# EAGLE design MrRoboto (EAGLE 6.1)
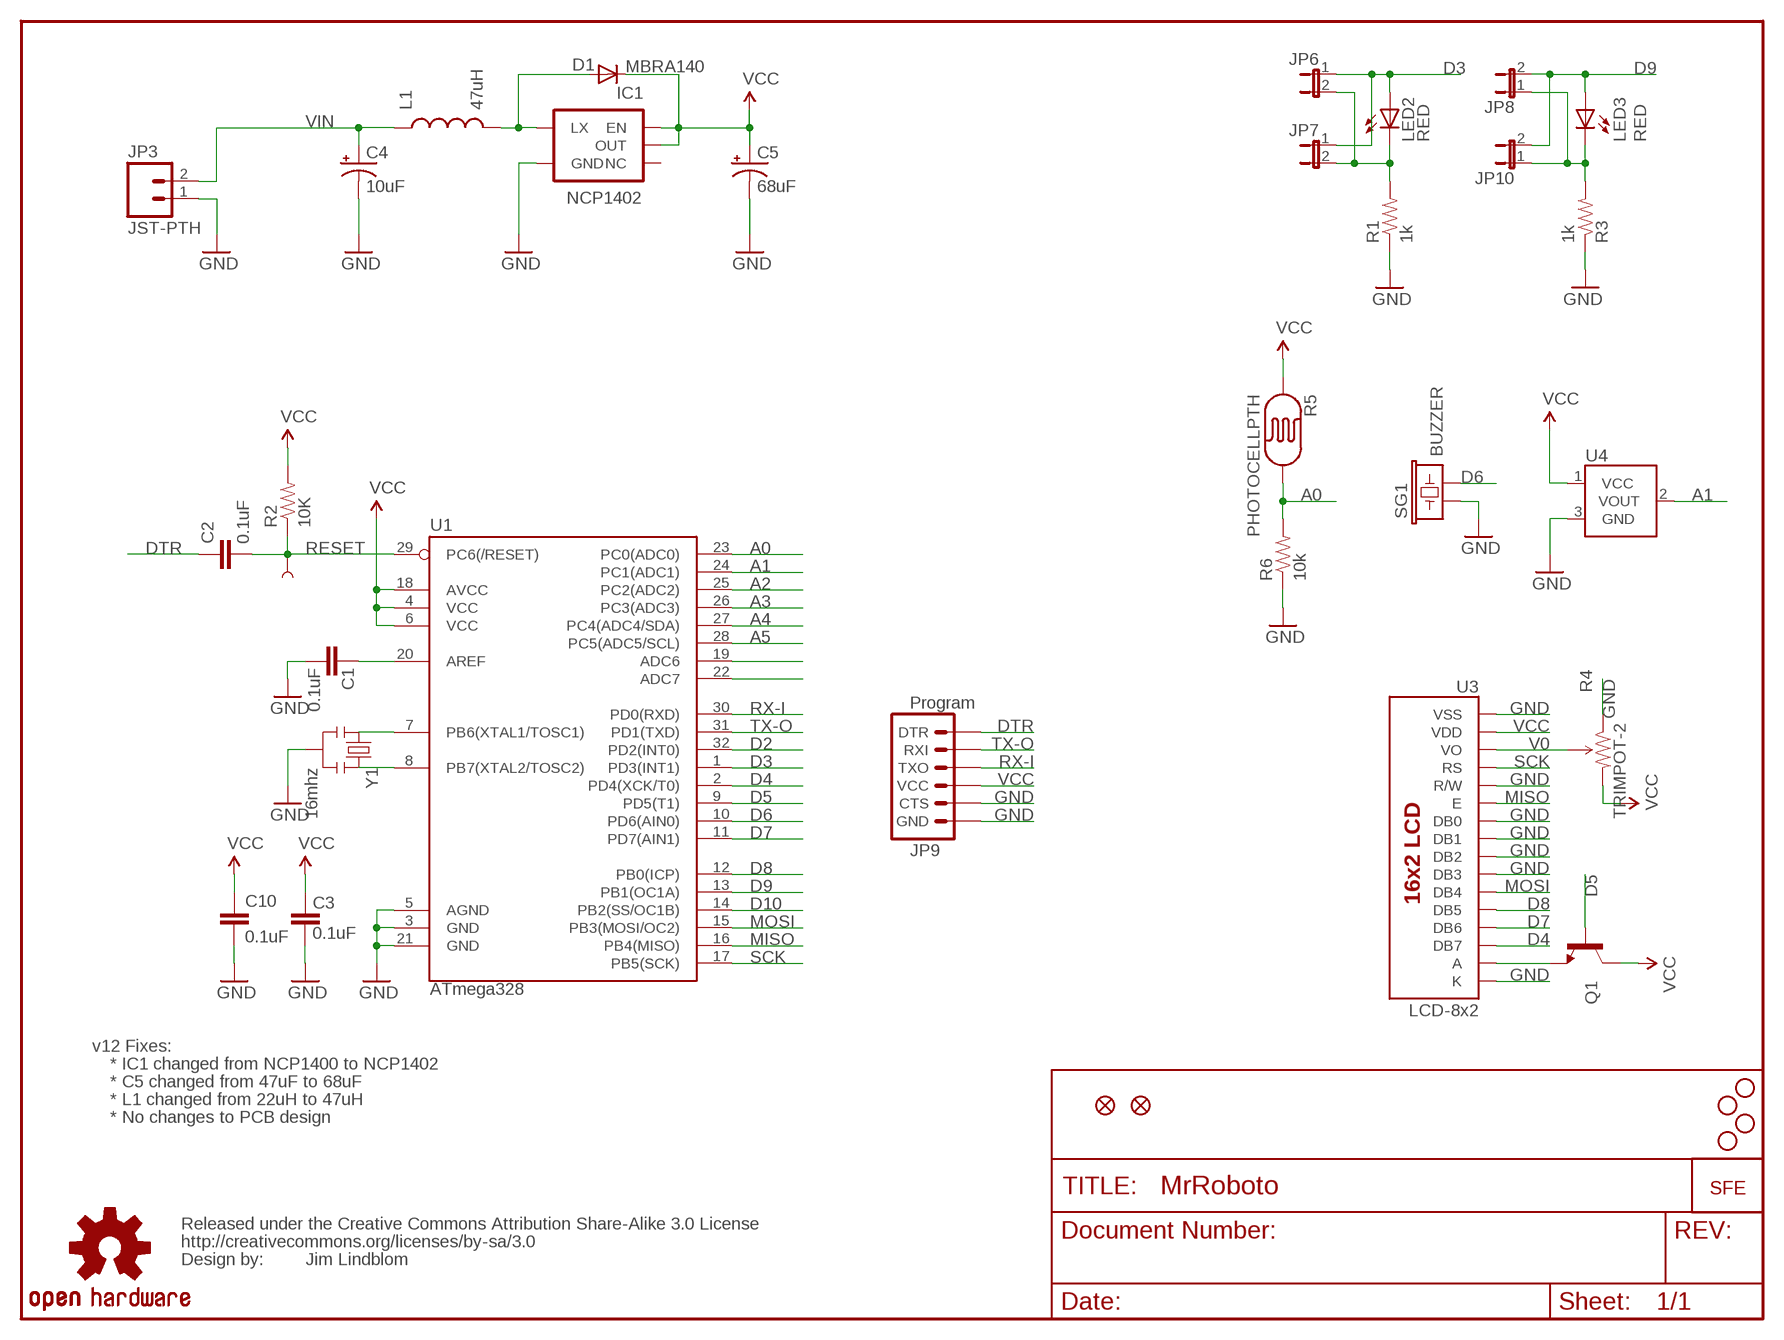
[diagram p0: schematic, sheet 1]

## Parts
C1  0.1uF  CAP0402-CAP  [0402-CAP]
C2  0.1uF  CAP0402-CAP  [0402-CAP]
C3  0.1uF  CAP0402-CAP  [0402-CAP]
C4  10uF  CAP_POL1206  [EIA3216]
C5  68uF  CAP_POL3528  [EIA3528]
C10  0.1uF  CAP0402-CAP  [0402-CAP]
D1  MBRA140  DIODESMA  [SMA-DIODE]
IC1  NCP1402  V_REG_NCP1400SOT23-5  [SOT23-5]
JP1  Long, Plastic  STAND-OFF  [STAND-OFF]
JP2  Long, Plastic  STAND-OFF  [STAND-OFF]
JP3  JST-PTH  M02JST-PTH-2-KIT  [JST-2-PTH-KIT]
JP4  Long, Plastic  STAND-OFF  [STAND-OFF]
JP5  Long, Plastic  STAND-OFF  [STAND-OFF]
JP6  JUMPER-2SMD-NO-NS  [SJ_2S-NO-NS]
JP7  JUMPER-2SMD-NO-NS  [SJ_2S-NO-NS]
JP8  JUMPER-2SMD-NO-NS  [SJ_2S-NO-NS]
JP9  Program  ARDUINO_SERIAL_PROGRAMPTH-KIT  [1X06-KIT]
JP10  JUMPER-2SMD-NO-NS  [SJ_2S-NO-NS]
JP11  FIDUCIAL1X2.5  [FIDUCIAL-1X2.5]
JP12  FIDUCIAL1X2.5  [FIDUCIAL-1X2.5]
L1  47uH  INDUCTORCR54  [CR54]
LED2  RED  LED5MM-KIT  [LED5MM-KIT]
LED3  RED  LED5MM-KIT  [LED5MM-KIT]
Q1  TRANSISTOR_NPNSOT23  [SOT23]
R1  1k  RESISTORKIT  [AXIAL-0.3-KIT]
R2  10K  RESISTOR0402-RES  [0402-RES]
R3  1k  RESISTORKIT  [AXIAL-0.3-KIT]
R4  TRIMPOT-2  [TRIMPOT_TC33]
R5  PHOTOCELLPTH  PHOTOCELLPTH-KIT  [PHOTOCELL-KIT]
R6  10k  RESISTOR0402-RES  [0402-RES]
SG1  BUZZER  BUZZERPTH-NS-KIT  [BUZZER-12MM-NS-KIT]
TP1  TP  TEST-POINT3X5  [PAD.03X.05]
U1  ATmega328  ATMEGA168  [TQFP32-08]
U3  LCD-8x2  LCD-16X28X2-KIT  [LCD-8X2-KIT]
U4  TMP36TO-92-KIT  [TO-92-KIT]
U$1  CREATIVE_COMMONS  [CREATIVE_COMMONS]
U$2  OSHW-LOGOM  [OSHW-LOGO-M]
U$3  LOGO-SFENEW  [SFE-NEW-WEBLOGO]
Y1  16mhz  RESONATORSMD  [RESONATOR-SMD]

## Nets
A0: R5.2 R6.2 U1.23(PC0(ADC0))
A1: U1.24(PC1(ADC1)) U4.2(VOUT)
A2: U1.25(PC2(ADC2))
A3: U1.26(PC3(ADC3))
A4: U1.27(PC4(ADC4/SDA))
A5: U1.28(PC5(ADC5/SCL))
AREF: C1.2 U1.20(AREF)
D2: U1.32(PD2(INT0))
D3: JP6.1 JP7.1 LED2.A U1.1(PD3(INT1))
D4: U1.2(PD4(XCK/T0)) U3.14(DB7)
D5: Q1.1(B) U1.9(PD5(T1))
D6: SG1.- U1.10(PD6(AIN0))
D7 [vcc]: U1.11(PD7(AIN1)) U3.13(DB6)
D8 [vcc]: U1.12(PB0(ICP)) U3.12(DB5)
D9 [vcc]: JP8.2 JP10.2 LED3.A U1.13(PB1(OC1A))
D10: U1.14(PB2(SS/OC1B))
DTR: C2.1 JP9.1(DTR)
GND [vcc]: C1.1 C3.1 C4.C(-) C5.C(-) C10.2 IC1.4(GND) JP3.1 JP9.5(CTS) JP9.6(GND) R1.P$1 R3.P$1 R4.1(CCW) R6.1 SG1.+ U1.3(GND) U1.5(AGND) U1.21(GND) U3.1(VSS) U3.5(R/W) U3.7(DB0) U3.8(DB1) U3.9(DB2) U3.10(DB3) U3.16(K) U4.3(GND) Y1.2
MISO: U1.16(PB4(MISO)) U3.6(E)
MOSI: U1.15(PB3(MOSI/OC2)) U3.11(DB4)
N$1: D1.A IC1.5(LX) L1.P$2
N$3: Q1.2(E) U3.15(A)
N$4: U1.7(PB6(XTAL1/TOSC1)) Y1.1
N$5: JP8.1 JP10.1 LED3.K(C) R3.P$2
N$6: U1.8(PB7(XTAL2/TOSC2)) Y1.3
N$7 [vcc]: JP6.2 JP7.2 LED2.K(C) R1.P$2
N$12: U1.19(ADC6)
N$13: U1.22(ADC7)
RESET: C2.2 R2.1 TP1.P$1 U1.29(PC6(/RESET))
RX-I: JP9.3(TXO) U1.30(PD0(RXD))
SCK: U1.17(PB5(SCK)) U3.4(RS)
TX-O: JP9.2(RXI) U1.31(PD1(TXD))
V0: R4.2(WIPER) U3.3(VO)
VCC: C3.2 C5.A(+) C10.1 D1.C IC1.1(EN) IC1.2(OUT) JP9.4(VCC) Q1.3(C) R2.2 R4.3(CW) R5.1 U1.4(VCC) U1.6(VCC) U1.18(AVCC) U3.2(VDD) U4.1(VCC)
VIN: C4.A(+) JP3.2 L1.P$1
Unconnected: IC1.3(NC)

## Notes on the sheet
- v12 Fixes:
- * IC1 changed from NCP1400 to NCP1402
- * C5 changed from 47uF to 68uF
- * L1 changed from 22uH to 47uH
- * No changes to PCB design
- Jim Lindblom

## Library data of the parts
C1-C3 C10 = SparkFun:CAP: Capacitor Standard 0603 ceramic capacitor, and 0.1" leaded capacitor.
C4 C5 = SparkFun:CAP_POL: Capacitor Polarized These are standard SMD and PTH capacitors. Normally 10uF, 47uF, and 100uF in electrolytic and tantalum varieties. Always verify the external diameter of the through hole cap, it varies with capacity, voltage, and manufacturer. The EIA devices should be standard.
D1 = SparkFun:DIODE: Diode These are standard reverse protection diodes and small signal diodes. SMA package can handle up to about 1A. SOD-323 can handle about 200mA. What the SOD-323 package when ordering, there are some mfgs out there that are 5-pin packages.
IC1 = SparkFun:V_REG_NCP1400: Switching step-up voltage regulator NCP1400 switiching regulator takes single cell AA and outputs 100mA at 3.3V or 5V with minimal number of external components.
JP1 JP2 JP4 JP5 = SparkFun:STAND-OFF: Stand Off This is the mechanical footprint for a #4 phillips button head screw. Use the keepout ring to avoid running the screw head into surrounding components. SKU : PRT-00447
JP3 = SparkFun:M02: Header 2 Standard 2-pin 0.1" header. Use with straight break away headers (SKU : PRT-00116), right angle break away headers (PRT-00553), swiss pins (PRT-00743), machine pins (PRT-00117), and female headers (PRT-00115). Molex polarized connector foot print use with SKU : PRT-08233 with associated crimp pins and housings.
JP6-JP8 JP10 = SparkFun:JUMPER-2: Jumper Basic 0.1" spaced jumper. Use with breakaway headers.
JP9 = SparkFun:ARDUINO_SERIAL_PROGRAM
JP11 JP12 = abes:FIDUCIAL: Fiducial Alignment Points Various fiducial points for machine vision alignment.
L1 = SparkFun:INDUCTOR: Inductors Basic Inductor/Choke - 0603 and 1206. Footprints are not proven and vary greatly between part numbers.
LED2 LED3 = SparkFun:LED: LEDs Standard schematic elements and footprints for 5mm, 3mm, 1206, and 0603 sized LEDs. 5mm - Spark Fun Electronics SKU : COM-00529 (and others)
Q1 = SparkFun:TRANSISTOR_NPN: Transistor NPN BJT configuration in SOT23 package. MMBT2222 is the common NPN we use. Double check BCE configuration again layout.
R1-R3 R6 = SparkFun:RESISTOR: Resistor Basic schematic elements and footprints for 0603, 1206, and PTH resistors.
R4 = SparkFun:TRIMPOT
R5 = SparkFun:PHOTOCELL: Photocell Also known as a CdS photoresistor. This is a low cost way to detect light levels. Resistance decreases with more incoming light. SparkFun SKU: SEN-09088
SG1 = SparkFun:BUZZER: Buzzer 12mm Spark Fun Electronics SKU : Comp-Buzzer
TP1 = SparkFun:TEST-POINT
U1 = SparkFun:ATMEGA168
U3 = SparkFun:LCD-16X2
U4 = SparkFun:TMP36
U$1 = SparkFun:CREATIVE_COMMONS
U$2 = SparkFun:OSHW-LOGO: Open Source Hardware Logo This logo indicates the piece of hardware it is found on incorporates a OSHW license and/or adheres to the definition of open source hardware found here: http://freedomdefined.org/OSHW
U$3 = SparkFun:LOGO-SFE: Spark Fun Electronics PCB Logo This is the standard Spark Fun Electronics PCB logo.
Y1 = SparkFun:RESONATOR: Resonator Small SMD resonator. This is the itty bitty 10/20MHz resonators with built in caps. CSTCE10M0G55 and CSTCE20M0V53. Footprint has been reviewed closely but hasn't been tested yet.

## Net classes
1 vcc: width 0.254 mm

## Board
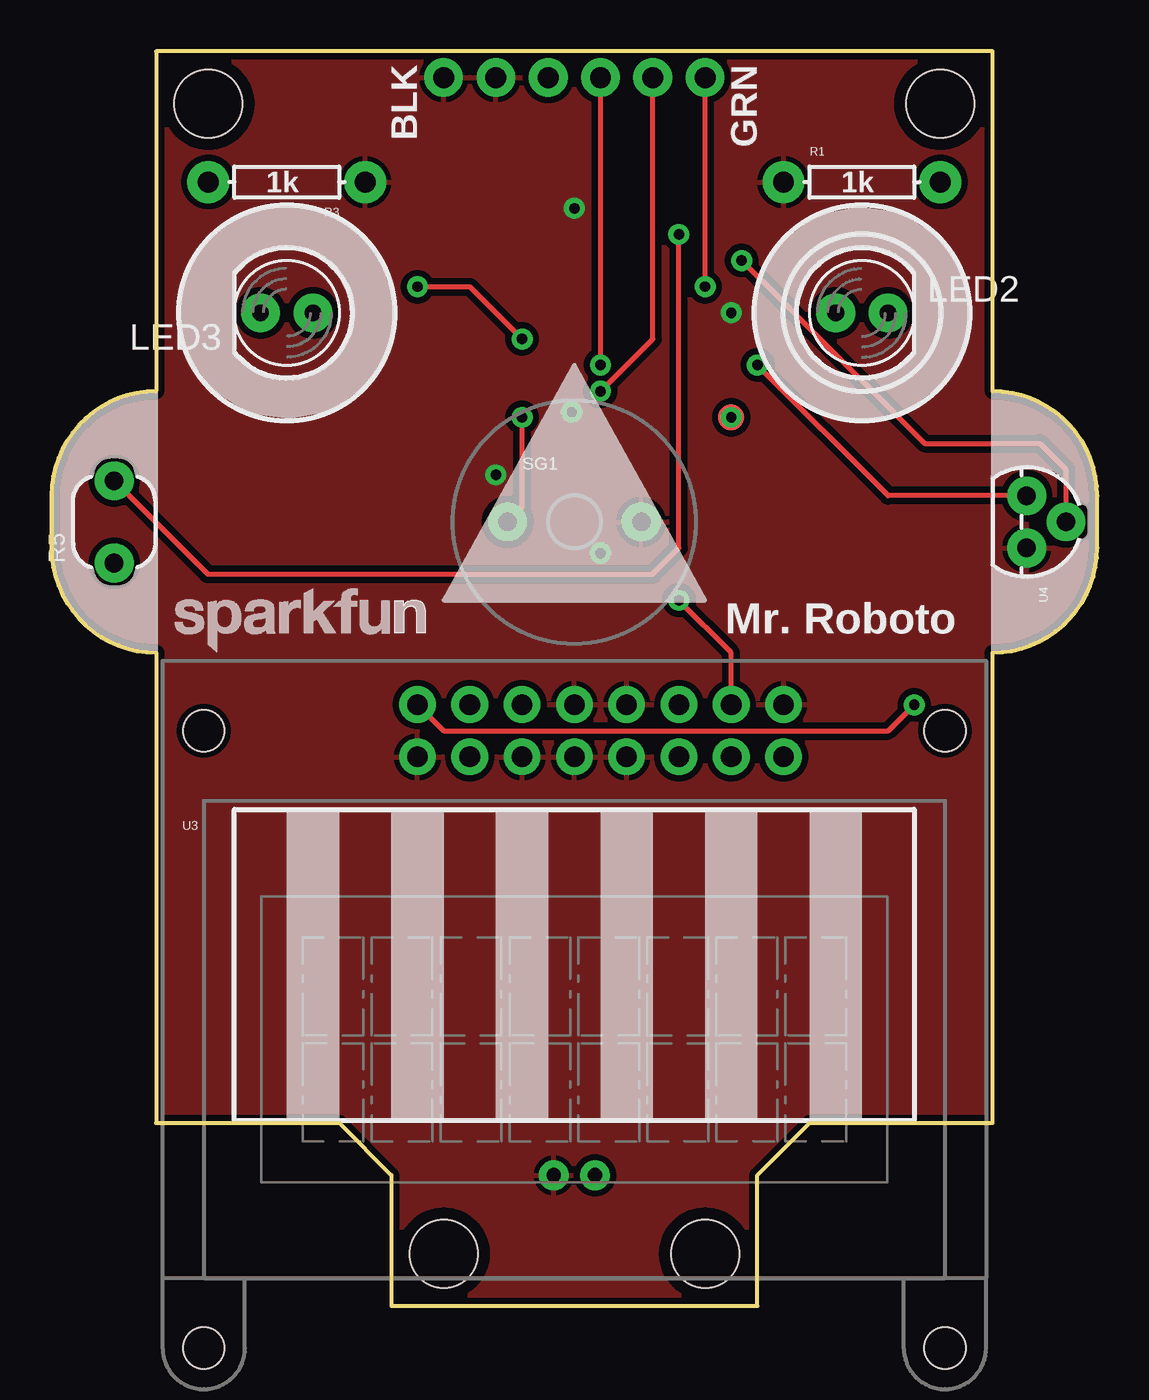
[diagram p1: board, top side]
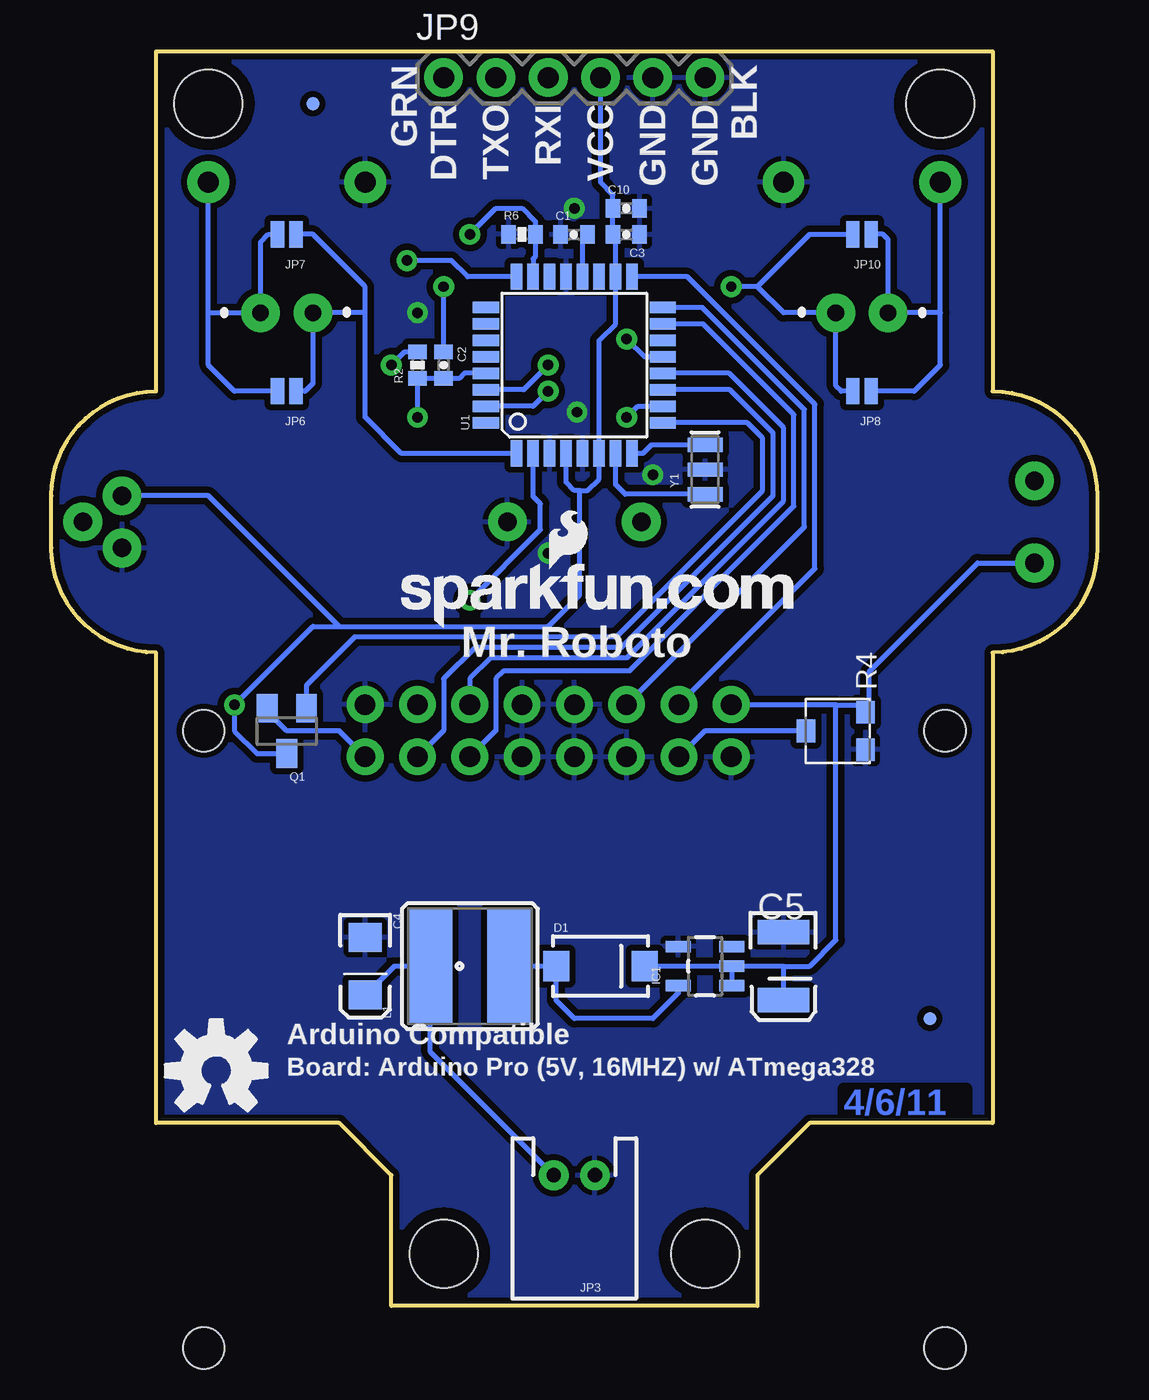
[diagram p2: board, bottom side, seen from below]

Size 50.8 x 60.96 mm. Coordinates in mm from the lower left corner, seen from the top.
Outline: 5.08,60.96 5.08,44.45 arc90 0,39.37 0,36.83 arc90 5.08,31.75 5.08,8.89 13.97,8.89 16.51,6.35 16.51,0 34.29,0 34.29,6.35 36.83,8.89 45.72,8.89 45.72,31.75 arc90 50.8,36.83 50.8,39.37 arc90 45.72,44.45 45.72,60.96 5.08,60.96
Copper layers (1*16): Top 0.035mm / dielectric 1.5mm / Bottom 0.035mm
Design rules: minimum track width 8mil, minimum drill 20mil, track to track 8mil, track to pad 8mil, pad to pad 8mil, via to via 8mil, smd to smd 8mil, copper to edge 8mil, drill to drill 8mil, minimum pad ring 12mil, minimum via ring 10mil, stop-mask expansion 4mil, vias tented up to drill 20mil, thermal gap 10mil

### Footprints (pad centres in the part's own frame; a part is rotated, then mirrored left to right if it is on the bottom)
0402-CAP = smd 0.7 x 0.9: 1 -0.65,0; 2 0.65,0
EIA3216 = smd 1.4 x 1.6: A 1.4,0; C -1.4,0
EIA3528 = smd 1.2 x 2.5: A 1.65,0; C -1.65,0
SMA-DIODE = smd 1.27 x 1.47: A -2.15,0; C 2.15,0
SOT23-5 = smd 0.55 x 1.2: 1 -0.95,-1.3; 2 0,-1.3; 3 0.95,-1.3; 4 0.95,1.3; 5 -0.95,1.3
STAND-OFF = hole 3.302: 0,0
JST-2-PTH-KIT = drill 0.7 pad 1.448: 1 -1,0; 2 1,0
SJ_2S-NO-NS = smd 0.635 x 1.27: 1 -0.45,0; 2 0.45,0
1X06-KIT = drill 1.016 pad 1.88: 1 0,0; 2 2.54,0; 3 5.08,0; 4 7.62,0; 5 10.16,0; 6 12.7,0
FIDUCIAL-1X2.5 = smd 0.635 x 0.635: 1 0,0
CR54 = smd 5.5 x 2.15: P$1 0,1.92; P$2 0,-1.92
LED5MM-KIT = drill 0.813 pad 1.88: A -1.27,0; K 1.27,0
SOT23 = smd 1 x 1.4: 1 -0.95,-1.1; 2 0.95,-1.1; 3 0,1.1
AXIAL-0.3-KIT = drill 1.016 pad 2.032: P$1 -3.81,0; P$2 3.81,0
0402-RES = smd 0.7 x 0.9: 1 -0.65,0; 2 0.65,0
TRIMPOT_TC33 = smd 1.1 x 0.9: 1 -0.91,-1.45; 2 0,1.45; 3 0.91,-1.45
PHOTOCELL-KIT = drill 0.9 pad 1.88: 1 -2,0; 2 2,0
BUZZER-12MM-NS-KIT = drill 0.9 pad 1.88: + 3.25,0; - -3.25,0
PAD.03X.05 = smd 1.27 x 1.27: P$1 0,0
TQFP32-08 = smd 1.27 x 0.559: 1 -4.293,2.8; 2 -4.293,2; 3 -4.293,1.2; 4 -4.293,0.4; 5 -4.293,-0.4; 6 -4.293,-1.2; 7 -4.293,-2; 8 -4.293,-2.8; 17 4.293,-2.8; 18 4.293,-2; 19 4.293,-1.2; 20 4.293,-0.4; 21 4.293,0.4; 22 4.293,1.2; 23 4.293,2; 24 4.293,2.8 | smd 0.559 x 1.27: 9 -2.8,-4.293; 10 -2,-4.293; 11 -1.2,-4.293; 12 -0.4,-4.293; 13 0.4,-4.293; 14 1.2,-4.293; 15 2,-4.293; 16 2.8,-4.293; 25 2.8,4.293; 26 2,4.293; 27 1.2,4.293; 28 0.4,4.293; 29 -0.4,4.293; 30 -1.2,4.293; 31 -2,4.293; 32 -2.8,4.293
LCD-8X2-KIT = drill 1 pad 1.778: 1 -7.62,13.73; 2 -7.62,16.27; 3 -5.08,13.73; 4 -5.08,16.27; 5 -2.54,13.73; 6 -2.54,16.27; 7 0,13.73; 8 0,16.27; 9 2.54,13.73; 10 2.54,16.27; 11 5.08,13.73; 12 5.08,16.27; 13 7.62,13.73; 14 7.62,16.27; 15 10.16,13.73; 16 10.16,16.27 | hole 2: 18,15; -18,15; -18,-15; 18,-15
TO-92-KIT = drill 0.9 pad 1.88: 1 -1.27,0; 2 0,1.905; 3 1.27,0
RESONATOR-SMD = smd 0.7 x 1.7: 1 -1.2,0; 2 0,0; 3 1.2,0

### Placement (x,y rotation side)
C1  25.42,52.06 0 bottom
C2  31.75,45.72 270 bottom
C3  22.88,52.06 180 bottom
C4  35.56,16.51 270 bottom
C5  15.24,16.51 270 bottom
C10  22.88,53.33 0 bottom
D1  24.13,16.51 0 bottom
IC1  19.05,16.51 90 bottom
JP1  7.62,58.42 0 top
JP2  43.18,58.42 0 top
JP3  25.4,6.35 180 bottom
JP4  19.05,2.54 0 top
JP5  31.75,2.54 0 top
JP6  39.37,44.45 180 bottom
JP7  39.37,52.07 180 bottom
JP8  11.43,44.45 180 bottom
JP9  31.75,59.69 0 bottom
JP10  11.43,52.07 180 bottom
JP11  8.13,13.97 0 bottom
JP12  38.1,58.42 0 bottom
L1  30.48,16.51 90 bottom
LED2  39.37,48.26 0 top
LED3  11.43,48.26 180 top
Q1  39.37,27.94 180 bottom
R1  39.37,54.61 0 top
R2  33.02,45.72 90 bottom
R3  11.43,54.61 180 top
R4  12.7,27.94 90 bottom
R5  3.05,38.1 90 top
R6  27.94,52.07 0 bottom
SG1  25.4,38.1 0 top
TP1  33.02,43.18 0 top
U1  25.4,45.72 90 bottom
U3  25.4,12.95 0 top
U4  47.37,38.1 270 top
U$1  -5.08,-12.7 0 top  (outside the outline)
U$2  42.8,11.43 0 bottom
U$3  33.83,32.94 0 bottom
U$11  LOGO-SFENW2  [SFE-NEW-WEB]  5.97,31.75 0 top
Y1  19.05,40.64 90 bottom

### Tracks (layer width: path | path; a pad name or v marks a point on that pad's centre or on a via)
A0  (via drill 0.51)
  Top 0.254: R5.2 7.59,35.56 29.21,35.56 30.48,36.83 v30.48,52.07
  Bottom 0.254: U1.23 27.4,50.88 27.29,50.99 R6.2 27.29,52.69 27.94,53.34 29.21,53.34 v30.48,52.07
A1  (via drill 0.51)
  Top 0.254: U4.2 49.28,40.64 48.01,41.91 42.42,41.91 v33.53,50.8
  Bottom 0.254: U1.24 30.58,50.01 31.37,50.8 v33.53,50.8
AREF
  Bottom 0.254: U1.20 25,51.83 C1.2
D3
  Bottom 0.254: 35.56,48.26 LED2.A 38.1,44.83 38.48,44.45 JP6.1 | JP7.1 38.1,52.07 35.56,49.53 35.56,48.26 | 35.56,48.26 35.56,43.18 33.81,41.43 U1.1
D4  (via drill 0.51)
  Top 0.254: U3.14 33.02,31.75 v30.48,34.29
  Bottom 0.254: U1.2 27.4,39.34 27.05,38.99 27.05,37.72 v30.48,34.29
D5
  Bottom 0.254: U1.9 17.01,42.92 16.26,42.16 16.26,39.62 23.37,32.51 36.07,32.51 38.42,30.16 Q1.1
D6  (via drill 0.51)
  Top 0.254: v22.86,43.18 22.86,38.81 SG1.-
  Bottom 0.254: U1.10 22.32,43.72 v22.86,43.18
D7
  Bottom 0.254: U1.11 17.85,44.52 15.75,42.42 15.75,39.37 23.11,32 30.23,32 31.75,30.48 31.75,27.95 U3.13
D8
  Bottom 0.254: U1.12 17.89,45.32 15.24,42.67 15.24,39.12 22.86,31.5 29.46,31.5 30.48,30.48 U3.12
D9  (via drill 0.51)
  Top 0.254: v17.78,49.53 20.32,49.53 v22.86,46.99
  Bottom 0.254: U1.13 21.99,46.12 v22.86,46.99 | JP8.2 12.45,44.45 12.7,44.7 LED3.A 15.24,48.26 16.51,49.53 | JP10.2 13.97,52.07 16.51,49.53 | 16.51,49.53 v17.78,49.53
DTR  (via drill 0.51)
  Top 0.254: v31.75,49.53 JP9.1
  Bottom 0.254: C2.1 v31.75,49.53
GND  (via drill 0.51)
  other vias: 25.4,53.34 25.27,43.43 21.59,40.39 26.67,36.58 33.02,48.26
  pour Bottom (isolate 0.305): 0.02,60.95 50.82,60.95 50.82,-0.01 0.02,-0.01
  pour Top (isolate 0.305): 0.02,60.95 50.82,60.95 50.82,-0.01 0.02,-0.01
MISO
  Bottom 0.254: U1.16 19.18,48.52 14.22,43.56 14.22,37.86 U3.6
MOSI
  Bottom 0.254: U1.15 19.14,47.72 14.73,43.31 14.73,38.86 22.73,30.86 28.83,30.86 29.21,30.48 29.21,27.95 U3.11
N$1
  Bottom 0.254: IC1.5 20.35,15.21 21.59,13.97 25.4,13.97 26.28,14.85 D1.A L1.P$2
N$3
  Bottom 0.254: U3.15 36.82,27.94 39.37,27.94 40.32,28.89 Q1.2
N$4
  Bottom 0.254: U1.7 23.4,39.91 22.93,39.44 Y1.1
N$5
  Bottom 0.254: 7.62,48.26 7.62,45.72 8.89,44.45 JP8.1 | 7.62,48.26 R3.P$2 | 7.62,48.26 LED3.K 10.16,51.82 10.41,52.07 JP10.1
N$6
  Bottom 0.254: U1.8 22.07,41.43 21.66,41.84 Y1.3
N$7
  Bottom 0.254: 43.18,48.26 LED2.K 40.64,51.69 40.26,52.07 JP7.2 | JP6.2 41.91,44.45 43.18,45.72 43.18,48.26 | 43.18,48.26 R1.P$2
RESET  (via drill 0.51)
  Bottom 0.254: U1.29 30.75,45.32 31,45.07 C2.2 R2.1 TP1.P$1
  other vias: 33.02,43.18
RX-I  (via drill 0.51)
  Top 0.254: v26.67,45.72 JP9.3
  Bottom 0.254: U1.30 27.87,44.52 v26.67,45.72
SCK
  Bottom 0.254: U1.17 19.91,50.01 13.72,43.81 13.72,35.83 U3.4
TX-O  (via drill 0.51)
  Top 0.254: v26.67,44.45 29.21,46.99 JP9.2
  Bottom 0.254: U1.31 27.4,43.72 v26.67,44.45
V0
  Bottom 0.254: R4.2 19.06,27.94 U3.3
VCC  (via drill 0.51)
  Top 0.254: U4.1 40.64,39.37 v34.29,45.72 | U3.2 19.06,27.94 40.64,27.94 v41.91,29.21
  Bottom 0.254: U1.4 25.8,40.02 25.4,39.62 25.15,39.62 | 25.15,39.62 24.77,39.62 24.2,40.19 U1.6 24.2,46.92 23.4,47.72 U1.18 23.4,51.93 C3.2 C10.1 23.53,54.01 24.13,54.61 JP9.4 | 25.15,39.62 25.15,34.54 26.67,33.02 36.83,33.02 | IC1.2 D1.C | IC1.2 IC1.1 | 15.24,16.51 IC1.2 | C5.A 15.24,16.51 | 15.24,16.51 13.97,16.51 12.7,17.78 12.7,29.21 | 12.7,29.21 11.61,29.21 R4.3 11.07,28.85 11.07,30.84 5.81,36.1 R5.1 | R2.2 33.64,46.37 v34.29,45.72 | 36.83,33.02 43.18,39.37 U4.1 | 12.7,29.21 17.77,29.21 U3.2 | 36.83,33.02 38.1,33.02 v41.91,29.21 41.91,27.94 40.81,26.84 Q1.3
VIN
  Bottom 0.254: C4.A 34.16,16.51 L1.P$1 32.4,12.35 JP3.2

### Text on the board
Bottom: 4/6/11
tPlace: BLK | GRN | Mr. Roboto
bPlace: BLK | GRN | GND | GND | VCC | RXI | TXO | DTR | Mr. Roboto | Arduino Compatible | Board: Arduino Pro (5V, 16MHZ) w/ ATmega328